# EAGLE design xbee (EAGLE 6.1)
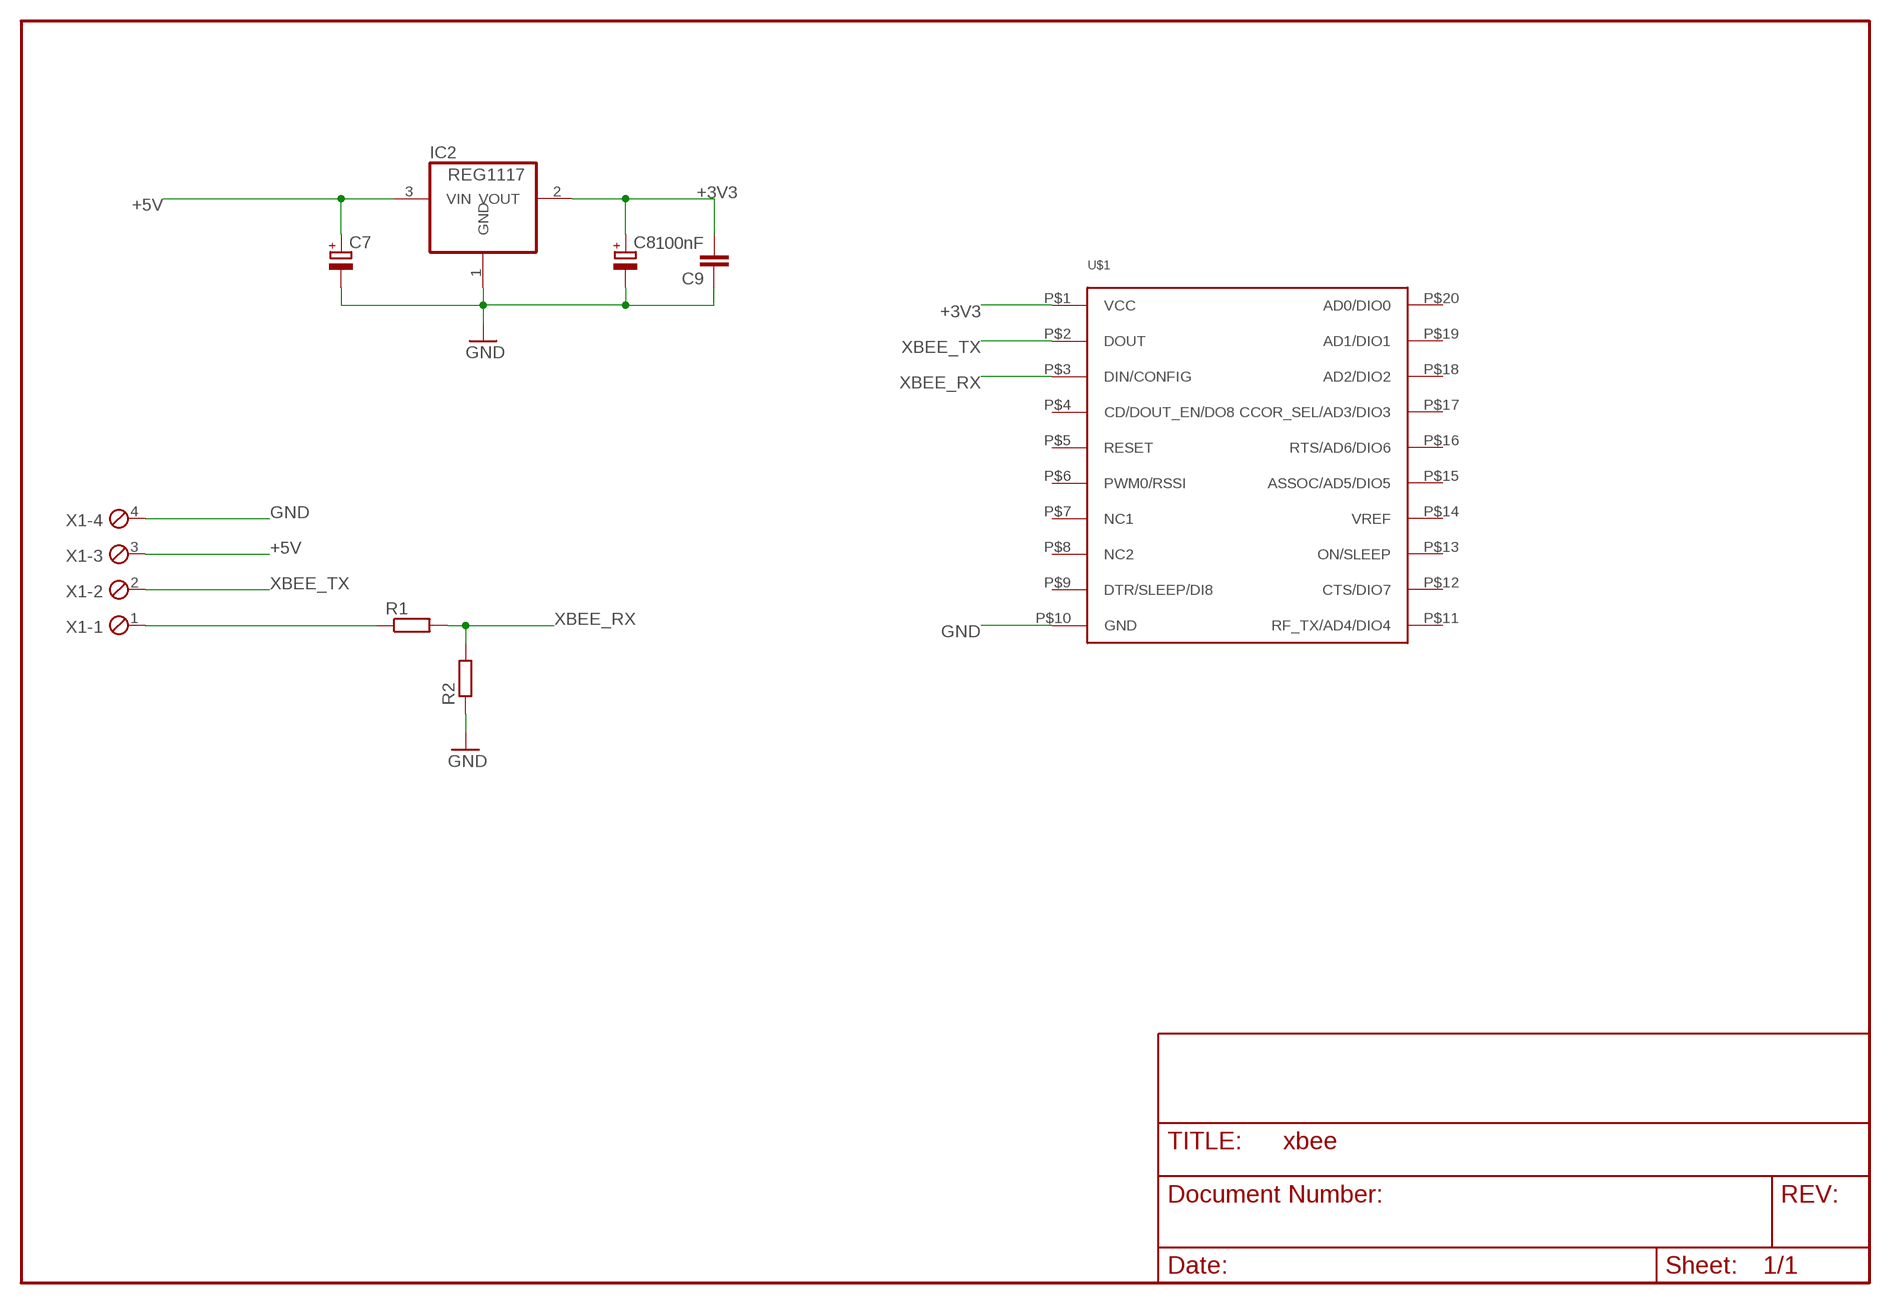
[diagram p0: schematic, sheet 1]

## Parts
C7  CPOL-EUA/3216-18R  [A/3216-18R]
C8  CPOL-EUB/3528-21R  [B/3528-21R]
C9  100nF  C-EUC0603  [C0603]
IC2  REG1117  [SOT223]
R1  R-EU_R1206W  [R1206W]
R2  R-EU_R1206W  [R1206W]
U$1  XBEEPRO  [XBEE]
X1  MPT4  [4POL254]

## Nets
+3V3: C8.+ C9.2 IC2.2(VOUT) U$1.P$1(VCC)
+5V: C7.+ IC2.3(VIN) X1.3
GND: C7.- C8.- C9.1 IC2.1(GND) R2.1 U$1.P$10(GND) X1.4
N$5: R1.1 X1.1
XBEE_RX: R1.2 R2.2 U$1.P$3(DIN/CONFIG)
XBEE_TX: U$1.P$2(DOUT) X1.2
Unconnected: U$1.P$4(CD/DOUT_EN/DO8) U$1.P$5(RESET) U$1.P$6(PWM0/RSSI) U$1.P$7(NC1) U$1.P$8(NC2) U$1.P$9(DTR/SLEEP/DI8) U$1.P$11(RF_TX/AD4/DIO4) U$1.P$12(CTS/DIO7) U$1.P$13(ON/SLEEP) U$1.P$14(VREF) U$1.P$15(ASSOC/AD5/DIO5) U$1.P$16(RTS/AD6/DIO6) U$1.P$17(CCOR_SEL/AD3/DIO3) U$1.P$18(AD2/DIO2) U$1.P$19(AD1/DIO1) U$1.P$20(AD0/DIO0)

## Library data of the parts
C7 C8 = rcl:CPOL-EU: POLARIZED CAPACITOR, European symbol
C9 = rcl:C-EU: CAPACITOR, European symbol
IC2 = burr-brown:REG1117: 800mA and 1A Low Dropout (LDO) Positive Regulator 1.8V, 2.5V, 2.85V, 3.3V, 5V, and Adj
R1 R2 = rcl:R-EU_: RESISTOR, European symbol
U$1 = paparazzi:XBEEPRO
X1 = con-phoenix-254:MPT4: PHOENIX CONNECTOR

## Board
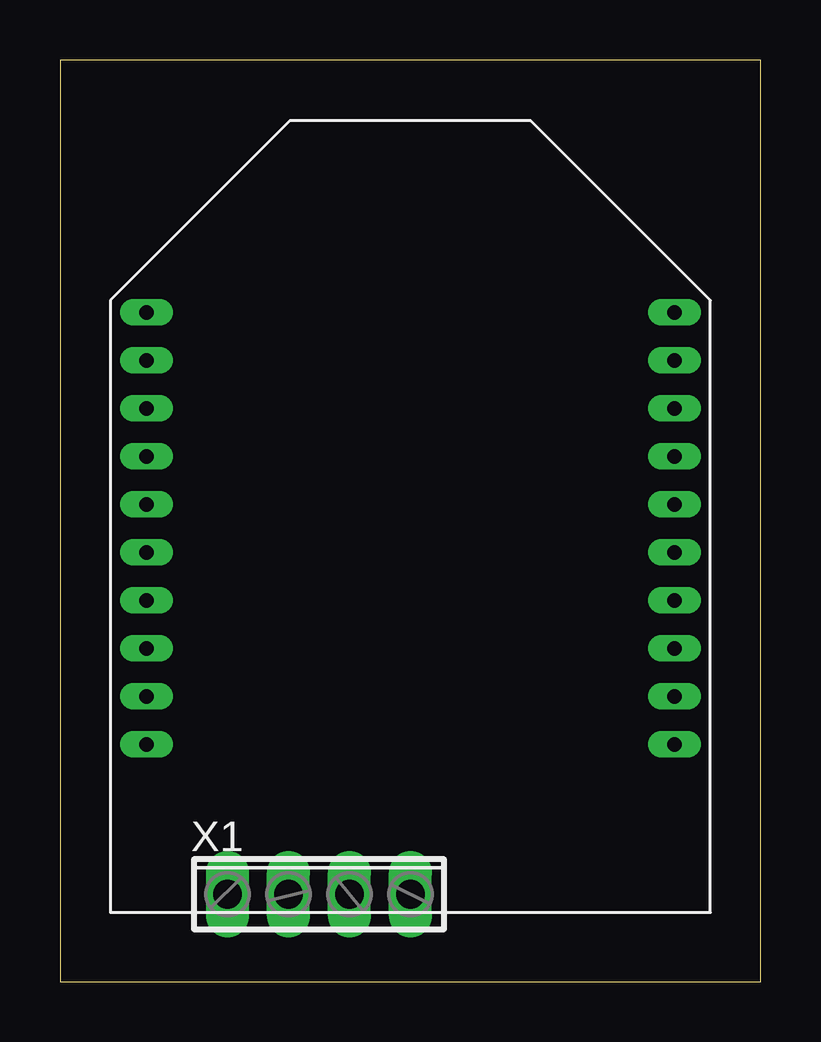
[diagram p1: board, top side]
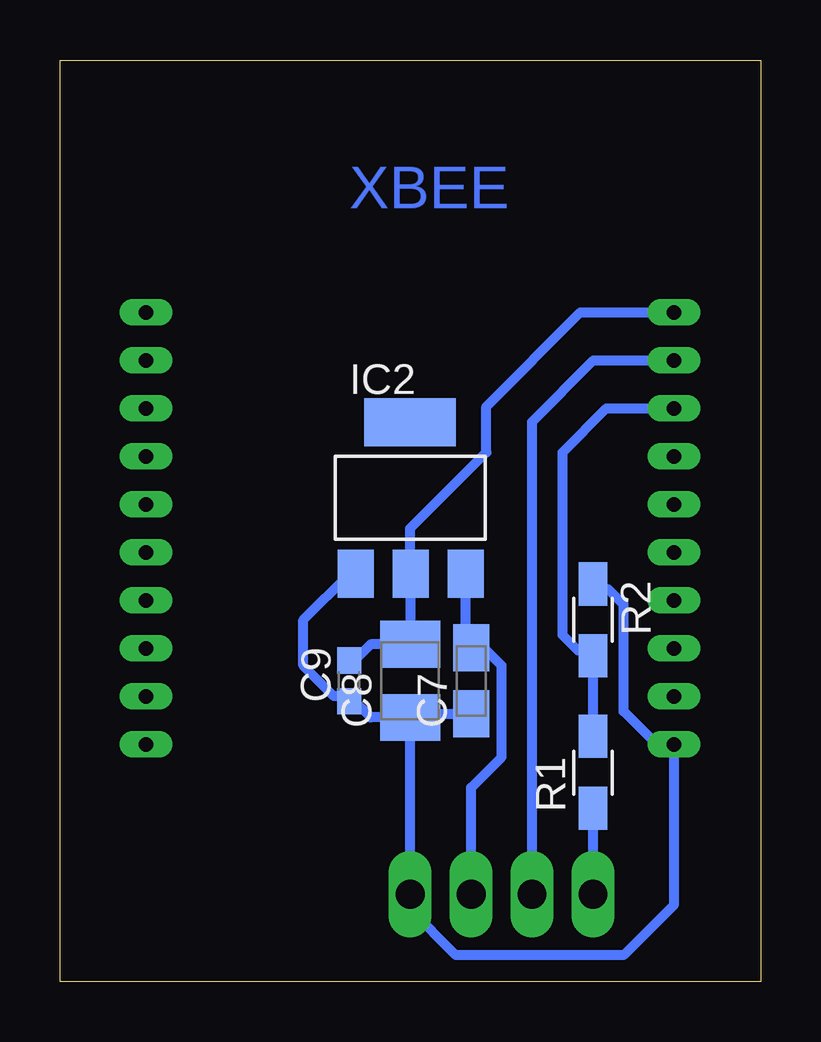
[diagram p2: board, bottom side, seen from below]

Size 29.19 x 38.4 mm. Coordinates in mm from the lower left corner, seen from the top.
Outline: 0,0 29.19,0 29.19,38.4 0,38.4 0,0
Copper layers (1*16): Top 0.035mm / dielectric 1.5mm / Bottom 0.035mm
Design rules: minimum track width 10mil, minimum drill 24mil, track to track 8mil, track to pad 8mil, pad to pad 8mil, via to via 8mil, smd to smd 8mil, copper to edge 40mil, drill to drill 8mil, minimum pad ring 10mil, minimum via ring 8mil, stop-mask expansion 4mil, vias tented up to drill 0mil, thermal gap 10mil

### Footprints (pad centres in the part's own frame; a part is rotated, then mirrored left to right if it is on the bottom)
A/3216-18R = smd 1.95 x 1.5: + 1.375,0; - -1.375,0
B/3528-21R = smd 1.95 x 2.5: + 1.525,0; - -1.525,0
C0603 = smd 1.1 x 1: 1 -0.85,0; 2 0.85,0
SOT223 = smd 1.499 x 2.007: 1 -2.261,-3.15; 2 0.025,-3.15; 3 2.311,-3.15 | smd 3.81 x 2.007: 4 0,3.15
R1206W = smd 1.8 x 1.2: 1 -1.499,0; 2 1.499,0
XBEE = drill 0.6 long: P$1 -11,9; P$2 -11,7; P$3 -11,5; P$4 -11,3; P$5 -11,1; P$6 -11,-1; P$7 -11,-3; P$8 -11,-5; P$9 -11,-7; P$10 -11,-9; P$11 11,-9; P$12 11,-7; P$13 11,-5; P$14 11,-3; P$15 11,-1; P$16 11,1; P$17 11,3; P$18 11,5; P$19 11,7; P$20 11,9
4POL254 = drill 1.2 long: 1 -3.81,0; 2 -1.27,0; 3 1.27,0; 4 3.81,0

### Placement (x,y rotation side)
C7  12.06,12.54 90 bottom
C8  14.6,12.54 90 bottom
C9  17.14,12.54 90 bottom
IC2  14.6,20.16 0 bottom
R1  6.98,8.72 90 bottom
R2  6.98,15.08 270 bottom
U$1  14.6,18.89 0 top
X1  10.79,3.65 0 top

### Tracks (layer width: path | path; a pad name or v marks a point on that pad's centre or on a via)
+3V3
  Bottom 0.406: C9.2 17.14,13.17 16.25,14.06 C8.+ 14.6,13.8 14.58,13.83 IC2.2 14.6,16.98 14.6,18.89 11.43,22.06 11.43,23.96 7.5,27.89 U$1.P$1
+5V
  Bottom 0.406: X1.3 12.06,8.09 10.79,9.36 10.79,13.17 11.43,13.8 12.06,13.8 | 12.06,13.8 C7.+ | IC2.3 12.29,14.03 12.06,13.8
GND
  Bottom 0.406: 14.6,11.27 C8.- 16.25,11.01 17.14,11.9 | C7.- 14.5,11.16 14.6,11.27 | 17.14,11.9 C9.1 | 14.6,11.27 X1.4 14.6,3.01 12.7,1.1 5.71,1.1 3.6,3.21 U$1.P$10 4.33,9.88 4.44,10 5.71,11.27 5.71,15.71 6.34,16.34 6.98,16.34 R2.1 | IC2.1 17.11,17 19.04,15.08 19.04,13.17 17.77,11.9 17.14,11.9
N$5
  Bottom 0.406: 6.98,7.46 R1.1 X1.1
XBEE_RX
  Bottom 0.406: R1.2 R2.2 6.98,13.8 7.62,13.8 8.25,14.44 8.25,22.06 6.42,23.89 U$1.P$3
XBEE_TX
  Bottom 0.406: X1.2 9.52,23.33 6.96,25.89 U$1.P$2

### Text on the board
Bottom: XBEE